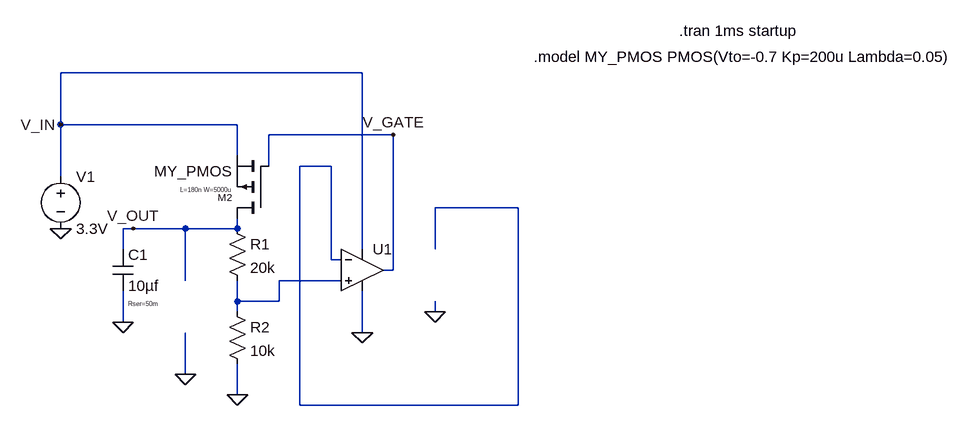
[diagram p0: schematic LDO_Subcircuit.asc]
LDO_Subcircuit.asc, the LTspice schematic file:
Version 4.1
SHEET 1 1176 680
WIRE 224 -32 -240 -32
WIRE -240 48 -240 -32
WIRE 32 48 -240 48
WIRE 272 64 80 64
WIRE 32 96 32 48
WIRE 80 112 80 64
WIRE 176 112 128 112
WIRE -240 128 -240 48
WIRE 464 176 336 176
WIRE -128 208 -144 208
WIRE -48 208 -128 208
WIRE 32 208 32 192
WIRE 32 208 -48 208
WIRE -144 240 -144 208
WIRE 224 240 224 -32
WIRE 336 240 336 176
WIRE 176 256 176 112
WIRE 192 256 176 256
WIRE 272 272 272 64
WIRE 272 272 256 272
WIRE -48 288 -48 208
WIRE 192 288 96 288
WIRE 32 320 32 288
WIRE 96 320 96 288
WIRE 96 320 32 320
WIRE 32 336 32 320
WIRE 336 336 336 320
WIRE -144 352 -144 304
WIRE 224 368 224 304
WIRE -48 432 -48 368
WIRE 32 464 32 416
WIRE 128 480 128 112
WIRE 464 480 464 176
WIRE 464 480 128 480
FLAG -240 208 0
FLAG 336 336 0
FLAG 32 464 0
FLAG -144 352 0
FLAG -48 432 0
FLAG 224 368 0
FLAG -128 208 V_OUT
FLAG -240 48 V_IN
FLAG 272 64 V_GATE
SYMBOL voltage -240 112 R0
WINDOW 123 0 0 Left 0
WINDOW 39 0 0 Left 0
SYMATTR InstName V1
SYMATTR Value 3.3V
SYMBOL res 16 192 R0
SYMATTR InstName R1
SYMATTR Value 20k
SYMBOL res 16 320 R0
SYMATTR InstName R2
SYMATTR Value 10k
SYMBOL pmos 80 192 R180
WINDOW 0 56 32 Left 1
WINDOW 39 56 44 Left 0
SYMATTR InstName M2
SYMATTR SpiceLine L=180n W=5000u
SYMATTR Value MY_PMOS
SYMBOL cap -160 240 R0
WINDOW 39 24 84 Left 0
SYMATTR SpiceLine Rser=50m
SYMATTR InstName C1
SYMATTR Value 10µf
SYMBOL OpAmps\\UniversalOpAmp2 224 272 R0
SYMATTR InstName U1
TEXT 712 -96 Left 2 !.tran 1ms startup
TEXT 488 -56 Left 2 !.model MY_PMOS PMOS(Vto=-0.7 Kp=200u Lambda=0.05)

The netlist it stands for:
* LDO_Subcircuit.asc
V1 V_IN 0 3.3V
R1 V_OUT N002 20k
R2 N002 0 10k
M2 V_OUT V_GATE V_IN V_IN MY_PMOS L=180n W=5000u
C1 V_OUT 0 10µf Rser=50m
X§U1 N002 N001 V_IN 0 V_GATE level2 Avol=1Meg GBW=10Meg Slew=10Meg Ilimit=25m Rail=0 Vos=0 En=0 Enk=0 In=0 Ink=0 Rin=500Meg  ; pins In+ In- V+ V- OUT
.model NMOS NMOS
.model PMOS PMOS
.lib standard.mos
.tran 1ms startup
.model MY_PMOS PMOS(Vto=-0.7 Kp=200u Lambda=0.05)
.lib UniversalOpAmp2.lib
.backanno
.end